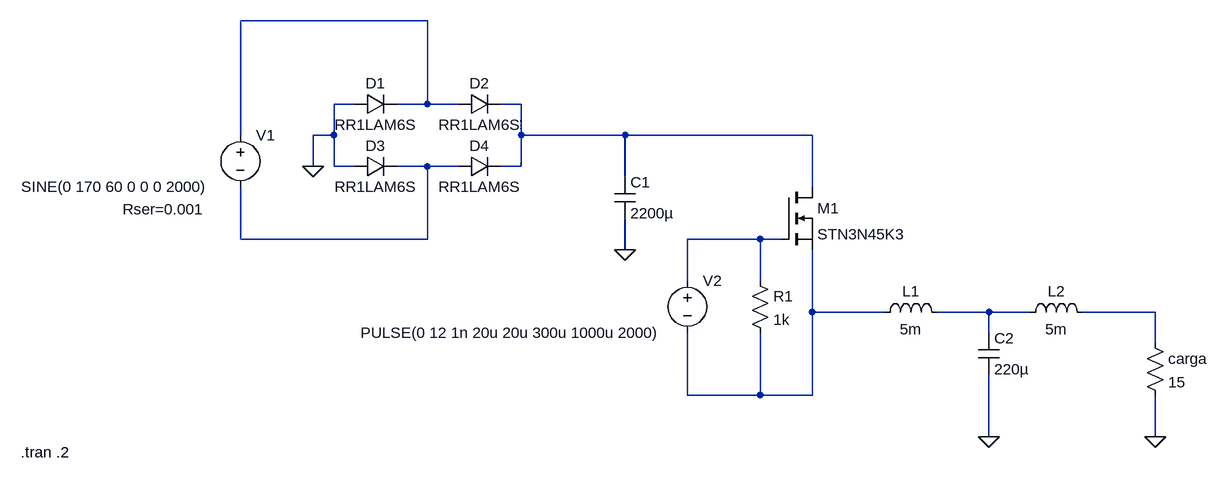
[diagram p0: schematic main.asc]
main.asc, the LTspice schematic file:
Version 4
SHEET 1 1448 680
WIRE 240 -32 -48 -32
WIRE 128 96 96 96
WIRE 240 96 240 -32
WIRE 240 96 192 96
WIRE 288 96 240 96
WIRE 384 96 352 96
WIRE -48 144 -48 -32
WIRE 96 144 96 96
WIRE 96 144 64 144
WIRE 384 144 384 96
WIRE 544 144 384 144
WIRE 832 144 544 144
WIRE 64 192 64 144
WIRE 96 192 96 144
WIRE 128 192 96 192
WIRE 240 192 192 192
WIRE 288 192 240 192
WIRE 384 192 384 144
WIRE 384 192 352 192
WIRE 544 208 544 144
WIRE 832 224 832 144
WIRE -48 304 -48 224
WIRE 240 304 240 192
WIRE 240 304 -48 304
WIRE 752 304 640 304
WIRE 784 304 752 304
WIRE 544 320 544 272
WIRE 640 368 640 304
WIRE 752 368 752 304
WIRE 832 416 832 320
WIRE 944 416 832 416
WIRE 1104 416 1024 416
WIRE 1168 416 1104 416
WIRE 1360 416 1248 416
WIRE 1104 448 1104 416
WIRE 1360 464 1360 416
WIRE 640 544 640 448
WIRE 752 544 752 448
WIRE 752 544 640 544
WIRE 832 544 832 416
WIRE 832 544 752 544
WIRE 1104 608 1104 512
WIRE 1360 608 1360 544
FLAG 64 192 0
FLAG 544 320 0
FLAG 1104 608 0
FLAG 1360 608 0
SYMBOL voltage -48 128 R0
WINDOW 3 -337 95 Left 2
WINDOW 123 0 0 Left 0
WINDOW 39 -181 130 Left 2
SYMATTR InstName V1
SYMATTR Value SINE(0 170 60 0 0 0 2000)
SYMATTR SpiceLine Rser=0.001
SYMBOL diode 128 112 R270
WINDOW 0 32 32 VTop 2
WINDOW 3 0 32 VBottom 2
SYMATTR InstName D1
SYMATTR Value RR1LAM6S
SYMBOL diode 288 112 R270
WINDOW 0 32 32 VTop 2
WINDOW 3 0 32 VBottom 2
SYMATTR InstName D2
SYMATTR Value RR1LAM6S
SYMBOL cap 528 208 R0
SYMATTR InstName C1
SYMATTR Value 2200µ
SYMBOL nmos 784 224 R0
SYMATTR InstName M1
SYMATTR Value STN3N45K3
SYMBOL ind 928 432 R270
WINDOW 0 32 56 VTop 2
WINDOW 3 5 56 VBottom 2
SYMATTR InstName L1
SYMATTR Value 5m
SYMATTR SpiceLine Rser=.02 Rpar=1Meg
SYMBOL cap 1088 448 R0
SYMATTR InstName C2
SYMATTR Value 220µ
SYMBOL res 1344 448 R0
SYMATTR InstName carga
SYMATTR Value 15
SYMBOL voltage 640 352 R0
WINDOW 3 -503 96 Left 2
WINDOW 123 0 0 Left 0
WINDOW 39 0 0 Left 0
SYMATTR InstName V2
SYMATTR Value PULSE(0 12 1n 20u 20u 300u 1000u 2000)
SYMBOL diode 128 208 R270
WINDOW 0 32 32 VTop 2
WINDOW 3 0 32 VBottom 2
SYMATTR InstName D3
SYMATTR Value RR1LAM6S
SYMBOL diode 288 208 R270
WINDOW 0 32 32 VTop 2
WINDOW 3 0 32 VBottom 2
SYMATTR InstName D4
SYMATTR Value RR1LAM6S
SYMBOL ind 1152 432 R270
WINDOW 0 32 56 VTop 2
WINDOW 3 5 56 VBottom 2
SYMATTR InstName L2
SYMATTR Value 5m
SYMATTR SpiceLine Rser=.02 Rpar=1Meg
SYMBOL res 736 352 R0
SYMATTR InstName R1
SYMATTR Value 1k
TEXT -386 632 Left 2 !.tran .2

The netlist it stands for:
* main.asc
V1 N001 N003 SINE(0 170 60 0 0 0 2000) Rser=0.001
D1 0 N001 RR1LAM6S
D2 N001 N002 RR1LAM6S
C1 N002 0 2200µ
M1 N002 N004 N005 N005 STN3N45K3
L1 N005 N006 5m Rser=.02 Rpar=1Meg
C2 N006 0 220µ
R§carga N007 0 15
V2 N004 N005 PULSE(0 12 1n 20u 20u 300u 1000u 2000)
D3 0 N003 RR1LAM6S
D4 N003 N002 RR1LAM6S
L2 N006 N007 5m Rser=.02 Rpar=1Meg
R1 N004 N005 1k
.model D D
.lib standard.dio
.model NMOS NMOS
.model PMOS PMOS
.lib standard.mos
.tran .2
.backanno
.end